# Altium schematic sheet 4 - Connectors.SchDoc
size Tabloid
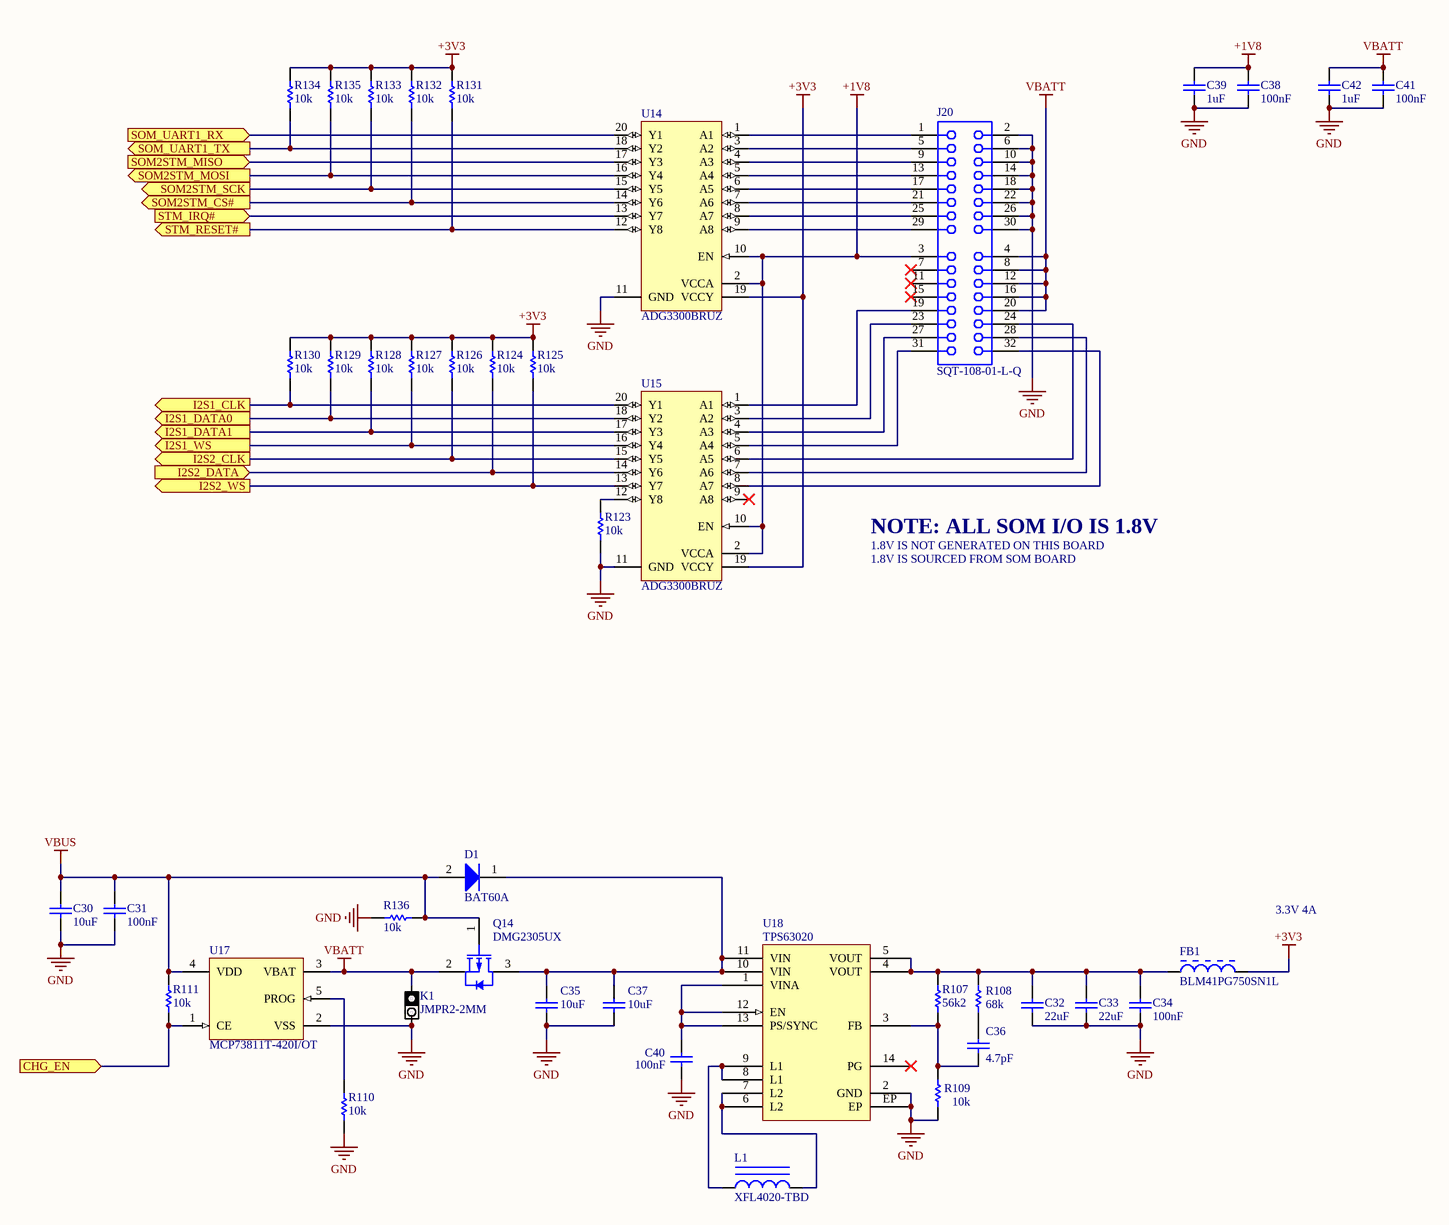
[diagram p0: 4 - Connectors.SchDoc]

## Parts
C30  value 10uF  [CAPC0805(2012)100_L]  (hidden comment: CAP 10uF 6.3V 0805(2012))
C31  value 100nF  [CAPC0805(2012)100_L]  (hidden comment: CAP 100nF 6.3V 0805(2012))
C32  value 22uF  [CAPC0805(2012)145_L]  (hidden comment: CAP 22uF 16V 0805(2012))
C33  value 22uF  [CAPC0805(2012)145_L]  (hidden comment: CAP 22uF 16V 0805(2012))
C34  value 100nF  [CAPC0805(2012)100_L]  (hidden comment: CAP 100nF 25V 0805(2012))
C35  value 10uF  [CAPC0805(2012)100_L]  (hidden comment: CAP 10uF 6.3V 0805(2012))
C36  value 4.7pF  [CAPC0805(2012)100_L]  (hidden comment: CAP 4.7pF 10V 0805(2012))
C37  value 10uF  [CAPC0805(2012)100_L]  (hidden comment: CAP 10uF 6.3V 0805(2012))
C38  value 100nF  [CAPC0805(2012)100_L]  (hidden comment: CAP 100nF 6.3V 0805(2012))
C39  value 1uF  [CAPC0805(2012)100_L]  (hidden comment: CAP 1uF 6.3V 0805(2012))
C40  value 100nF  [CAPC0805(2012)100_L]  (hidden comment: CAP 100nF 6.3V 0805(2012))
C41  value 100nF  [CAPC0805(2012)100_L]  (hidden comment: CAP 100nF 6.3V 0805(2012))
C42  value 1uF  [CAPC0805(2012)100_L]  (hidden comment: CAP 1uF 6.3V 0805(2012))
D1  BAT60A  [INF-SOD323_V]
FB1  BLM41PG750SN1L  [MURA-BLM41-B35-CHIP-2_V2]
J20  SQT-108-01-L-Q  [SMTC-SQT-108-01-X-Q]
K1  JMPR2-2MM  [JMPR2-2MM]
L1  XFL4020-TBD  [COILCRAFT_XFL4020]
Q14  DMG2305UX  [ONSC-SOT-23-3-318-08_V]
R107  value 56k2  [RESC0805(2012)_L]
R108  value 68k  [RESC0805(2012)_L]  (hidden comment: 68K 5% 0805(2012))
R109  value 10k  [RESC0805(2012)_L]  (hidden comment: 10K 1% 0805(2012))
R110  value 10k  [RESC0805(2012)_L]  (hidden comment: 10K 1% 0805(2012))
R111  value 10k  [RESC0805(2012)_L]  (hidden comment: 10K 1% 0805(2012))
R123  value 10k  [RESC0805(2012)_L]  (hidden comment: 10K 1% 0805(2012))
R124  value 10k  [RESC0805(2012)_L]  (hidden comment: 10K 1% 0805(2012))
R125  value 10k  [RESC0805(2012)_L]  (hidden comment: 10K 1% 0805(2012))
R126  value 10k  [RESC0805(2012)_L]  (hidden comment: 10K 1% 0805(2012))
R127  value 10k  [RESC0805(2012)_L]  (hidden comment: 10K 1% 0805(2012))
R128  value 10k  [RESC0805(2012)_L]  (hidden comment: 10K 1% 0805(2012))
R129  value 10k  [RESC0805(2012)_L]  (hidden comment: 10K 1% 0805(2012))
R130  value 10k  [RESC0805(2012)_L]  (hidden comment: 10K 1% 0805(2012))
R131  value 10k  [RESC0805(2012)_L]  (hidden comment: 10K 1% 0805(2012))
R132  value 10k  [RESC0805(2012)_L]  (hidden comment: 10K 1% 0805(2012))
R133  value 10k  [RESC0805(2012)_L]  (hidden comment: 10K 1% 0805(2012))
R134  value 10k  [RESC0805(2012)_L]  (hidden comment: 10K 1% 0805(2012))
R135  value 10k  [RESC0805(2012)_L]  (hidden comment: 10K 1% 0805(2012))
R136  value 10k  [RESC0805(2012)_L]  (hidden comment: 10K 1% 0805(2012))
U14  ADG3300BRUZ  [ADI-RU-20_N]
U15  ADG3300BRUZ  [ADI-RU-20_N]
U17  MCP73811T-420I/OT  [SOT-23-OT5_M]
U18  TPS63020  [VSON14]

## Ports
CHG_EN (in), I2S1_CLK (out), I2S1_DATA0 (out), I2S1_DATA1 (out), I2S1_WS (out), I2S2_CLK (out), I2S2_DATA (in), I2S2_WS (out), SOM2STM_CS# (out), SOM2STM_MISO (in), SOM2STM_MOSI (out), SOM2STM_SCK (out), SOM_UART1_RX (in), SOM_UART1_TX (out), STM_IRQ# (in), STM_RESET# (out)

## Nets
+1V8: C38.2 C39.2 J20.3 U14.2(VCCA) U14.10(EN) U15.2(VCCA) U15.10(EN)
+3V3: FB1.2 R124.1 R125.1 R126.1 R127.1 R128.1 R129.1 R130.1 R131.1 R132.1 R133.1 R134.1 R135.1 U14.19(VCCY) U15.19(VCCY)
GND: C30.1 C31.2 C32.1 C33.1 C34.1 C35.1 C37.1 C38.1 C39.1 C40.2 C41.1 C42.1 J20.2 J20.6 J20.10 J20.14 J20.18 J20.22 J20.26 J20.30 K1.2 R109.1 R110.1 R123.2 R136.2 U14.11(GND) U15.11(GND) U17.2(VSS) U18.2(GND) U18.EP
VBATT: C41.2 C42.2 J20.4 J20.8 J20.12 J20.16 J20.20 K1.1 Q14.2(S) U17.3(VBAT)
VBUS: C30.2 C31.1 D1.2(A) Q14.1(G) R111.1 R136.1 U17.4(VDD)
CHG_EN: R111.2 U17.1(CE) ; port CHG_EN
I2S1_CLK: R130.2 U15.20(Y1) ; port I2S1_CLK
I2S1_DATA0: R129.2 U15.18(Y2) ; port I2S1_DATA0
I2S1_DATA1: R128.2 U15.17(Y3) ; port I2S1_DATA1
I2S1_WS: R127.2 U15.16(Y4) ; port I2S1_WS
I2S2_CLK: R126.2 U15.15(Y5) ; port I2S2_CLK
I2S2_DATA: R124.2 U15.14(Y6) ; port I2S2_DATA
I2S2_WS: R125.2 U15.13(Y7) ; port I2S2_WS
SOM2STM_CS#: R132.2 U14.14(Y6) ; port SOM2STM_CS#
SOM2STM_MISO: U14.17(Y3) ; port SOM2STM_MISO
SOM2STM_MOSI: R135.2 U14.16(Y4) ; port SOM2STM_MOSI
SOM2STM_SCK: R133.2 U14.15(Y5) ; port SOM2STM_SCK
SOM_UART1_RX: U14.20(Y1) ; port SOM_UART1_RX
SOM_UART1_TX: R134.2 U14.18(Y2) ; port SOM_UART1_TX
STM_IRQ#: U14.13(Y7) ; port STM_IRQ#
STM_RESET#: R131.2 U14.12(Y8) ; port STM_RESET#
NetC32_2: C32.2 C33.2 C34.2 FB1.1 R107.2 R108.2 U18.4(VOUT) U18.5(VOUT)
NetC35_2: C35.2 C37.2 D1.1(K) Q14.3(D) U18.10(VIN) U18.11(VIN)
NetC36_1: C36.1 R107.1 R109.2 U18.3(FB)
NetC36_2: C36.2 R108.1
NetC40_1: C40.1 U18.1(VINA) U18.12(EN) U18.13(PS/SYNC)
NetJ20_1: J20.1 U14.1(A1)
NetJ20_5: J20.5 U14.3(A2)
NetJ20_9: J20.9 U14.4(A3)
NetJ20_13: J20.13 U14.5(A4)
NetJ20_17: J20.17 U14.6(A5)
NetJ20_19: J20.19 U15.1(A1)
NetJ20_21: J20.21 U14.7(A6)
NetJ20_23: J20.23 U15.3(A2)
NetJ20_24: J20.24 U15.6(A5)
NetJ20_25: J20.25 U14.8(A7)
NetJ20_27: J20.27 U15.4(A3)
NetJ20_28: J20.28 U15.7(A6)
NetJ20_29: J20.29 U14.9(A8)
NetJ20_31: J20.31 U15.5(A4)
NetJ20_32: J20.32 U15.8(A7)
NetL1_1: L1.1 U18.8(L1) U18.9(L1)
NetL1_2: L1.2 U18.6(L2) U18.7(L2)
NetR110_2: R110.2 U17.5(PROG)
NetR123_1: R123.1 U15.12(Y8)

Not connected (* = marked no-connect by the designer): J20 7* 11* 15*; U15 9(A8)*; U18 14(PG)*

## Notes on the sheet
- NOTE: ALL SOM I/O IS 1.8V
- 1.8V IS SOURCED FROM SOM BOARD
- 1.8V IS NOT GENERATED ON THIS BOARD
- 3.3V 4A

## Library data of the parts
C30 = CMP-1036-04917-1: CAP 10uF 6.3V Â±10% 0805 (2012 Metric) Thickness 1mm SMD; Case-EIA: 0805; Case-Metric: 2012; Max Thickness: 1 mm; Tolerance: Â±10%; Technology: SMT; Rated Voltage: 6.3 V
C31 C38 C40 C41 = CMP-1036-04391-1: CAP 100nF 6.3V Â±10% 0805 (2012 Metric) Thickness 1mm SMD; Case-EIA: 0805; Case-Metric: 2012; Rated Voltage: 6.3 V; Technology: SMT; Tolerance: Â±10%; Max Thickness: 1 mm
C32 C33 = CMP-1036-04946-1: CAP 22uF 16V Â±20% 0805 (2012 Metric) Thickness 1.45mm SMD; Case-Metric: 2012; Case-EIA: 0805; Tolerance: Â±20%; Max Thickness: 1.45 mm; Rated Voltage: 16 V; Technology: SMT
C34 = CMP-1036-04411-1: CAP 100nF 25V Â±10% 0805 (2012 Metric) Thickness 1mm SMD; Case-EIA: 0805; Case-Metric: 2012; Max Thickness: 1 mm; Rated Voltage: 25 V; Technology: SMT; Tolerance: Â±10%
C35 C37 = CMP-1036-04920-1: CAP 10uF 6.3V Â±20% 0805 (2012 Metric) Thickness 1mm SMD; Case-Metric: 2012; Case-EIA: 0805; Max Thickness: 1 mm; Tolerance: Â±20%; Rated Voltage: 6.3 V; Technology: SMT
C36 = CMP-1036-00526-1: CAP 4.7pF 10V Â±0.25pF 0805 (2012 Metric) Thickness 1mm SMD; Case-Metric: 2012; Case-EIA: 0805; Tolerance: Â±0.25pF; Rated Voltage: 10 V; Max Thickness: 1 mm; Technology: SMT
C39 C42 = CMP-1036-04730-1: CAP 1uF 6.3V Â±5% 0805 (2012 Metric) Thickness 1mm SMD; Case-Metric: 2012; Case-EIA: 0805; Technology: SMT; Tolerance: Â±5%; Max Thickness: 1 mm; Rated Voltage: 6.3 V
D1 = CMP-1183-00008-2: Silicon Schottky Diode, -55 to 85 degC, SOD323, Reel, Green; Manufacturer: Infineon; Green: TRUE; VR (max): 10Â V; IF (max): 3,000Â mA; VF (max): 370Â mV; CT (max): 35Â pF; Configuration: Single; PackageDescription: 3-Pin Small Outline Transistor Package, 1.25 x 2 mm Body, 0.65 mm Pitch; PartNumber: BAT60A; Mounting Technology: Surface Mount; PackageReference: SOT323; ComponentLink1Description: Manufacturer URL; Packing: Reel; ComponentLink3URL: http://www.infineon.com/dgdl/SOT323-Package_Overview.pdf?folderId=db3a30431936bc4b0119533e1dcb3c92&fileId=db3a30431936bc4b011953495f283cb1; ComponentLink2URL: http://www.infineon.com/dgdl/bat60aseries.pdf?folderId=db3a304313d846880113def5812204a1&fileId=db3a304313d846880113def70c9304a9; ComponentLink1URL: http://www.infineon.com/; ComponentLink2Description: Datasheet; ComponentLink3Description: Package Specification
FB1 = CMP-0686-00749-2: Chip Ferrite Bead for Power Lines, 75 Ohm, 3500 mA, -55 to 125 degC, 4.5 x 1.6 x 1.8 mm SMD, Tape and Reel; Manufacturer: Murata; Rated Current: 3500 mA; Impedance (at 100 MHz): 75 Ohm Typ.; DC Resistance: 0.015 Ohm Max.; PackageReference: BLM41-2; Packing: Tape and Reel; PartNumber: BLM41PG750SN1L; ComponentLink1URL: http://www.murata.com/; ComponentLink3Description: Package Specification; ComponentLink1Description: Manufacturer URL; ComponentLink3URL: http://www.murata.com/products/catalog/pdf/c31e.pdf; DatasheetVersion: 08/2013; PackageDescription: 2-Pin Chip, Body 4.5 x 1.6 mm; Operating Temperature Range: -55 to 125 degC; Mounting Technology: Surface Mount; ComponentLink2URL: http://www.murata.com/products/catalog/pdf/c31e.pdf; ComponentLink2Description: Datasheet
J20 = CMP-1021-00092-1: Cost-Effective Rugged Socket, Through-hole, Vertical, -55 to 125 degC, 2 mm Pitch, 32-Pin, Female, RoHS; Manufacturer: Samtec; Pitch: 2 mm; Mounting Technology: Through-hole; ComponentLink3URL: http://www.samtec.com/documents/webfiles/cpdf/SQT-1XX-XX-XXX-X-XXX-XXX-MKT.pdf; ComponentLink1URL: http://www.samtec.com; RoHS: True; DatasheetVersion: F-214; ComponentLink1Description: Manufacturer URL; PartNumber: SQT-108-01-L-Q; PackageReference: SQT-108-01-X-Q; PackageDescription: 2mm Socket Strip Assembly; ComponentLink2URL: http://www.samtec.com/documents/webfiles/pdf/SQT_TH.PDF; Orientation: Vertical; ComponentLink3Description: Package Specification; PackageVersion: BY, 7/1995; ComponentLink2Description: Datasheet; Temperature Range: -55 to 125 degC
K1 = JMPR2-2MM: JMPR2 2MM OPEN BY DEFAULT; Manufacturer: Sullins Connector Solutions; Manufacturer Part Number: PBC36SAAN; Supplier 1: Digi-Key; Supplier Part Number 1: S1011E-36-ND; Reel: Open
L1 = SHIELDED_INDUCTOR
Q14 = CMP-1058-00762-1: Power MOSFET Single P-Channel, -50 V, 10 Ohm, 3-Pin SOT-23, Pb-Free, Tape and Reel; Manufacturer: On Semiconductor; PartNumber: BSS84LT1G; Ciss Typ (pF): 36; ID Max (A): 0.13; Channel Polarity: P Channel; VGS(th) Max (V): 2; VGS Max (V): 20; V(BR)DSS Min (V): 50; Crss Typ (pF): 6.5; PD Max (W): 0.225; Coss Typ (pF): 17; Configuration: Single; Mounting Technology: Surface Mount; ComponentLink3URL: http://www.onsemi.cn/pub_link/Collateral/318-08.PDF; ComponentLink1Description: Manufacturer URL; Package Type: SOT-23-3; ComponentLink2URL: http://www.onsemi.com/pub_link/Collateral/BSS84LT1-D.PDF; RoHS: Pb-Free; Packing: Tape and Reel; ComponentLink1URL: http://www.onsemi.com/; PackageVersion: Rev. AP, 11/2009; PackageReference: SOT-23-3-318-08; PackageDescription: 3-Pin Small Outline Transistor, Body 2.92 x 1.3 mm, Pitch 0.95 mm; DatasheetVersion: Rev. 8; ComponentLink3Description: Package Specification; ComponentLink2Description: Datasheet
R107 = CMP-1013-00645-1: 56k2 1% 0805(2012); Case-Metric: 2012; Case-EIA: 0805; Power: 0.125 W; Tolerance: 1 %; Technology: SMT
R108 = CMP-1013-00118-1: 68K 0.125W 5% 0805 (2012 Metric)  SMD; Case-EIA: 0805; Case-Metric: 2012; Technology: SMT; Power: 0.125 W; Tolerance: 5 %
R109 = CMP-1013-00645-1: 10K 0.125W 1% 0805 (2012 Metric)  SMD; Case-Metric: 2012; Case-EIA: 0805; Tolerance: 1 %; Technology: SMT; Power: 0.125 W
R110 R111 R123-R136 = CMP-1013-00623-1: 10K 0.125W 1% 0805 (2012 Metric)  SMD; Case-Metric: 2012; Case-EIA: 0805; Tolerance: 1 %; Power: 0.125 W; Technology: SMT
U14 U15 = CMP-0791-00060-1: Low Voltage 1.15 V to 5.5 V, 8-Channel Bidirectional Logic Level Translator, -40 to 85 degC, 20-pin SOP (RU-20), Tube; Manufacturer: Analog Devices; Bus Enable Time (typ): 1us; Mounting Technology: Surface Mount; DatasheetVersion: Rev. 0; ComponentLink1Description: Manufacturer URL; ComponentLink2URL: http://www.analog.com/static/imported-files/data_sheets/ADG3300.pdf; PackageVersion: Jan-03; ComponentLink2Description: Datasheet; PackageReference: RU-20; ComponentLink3URL: http://www.analog.com/static/imported-files/packages/364515793657813558433715854054607941441RU20.pdf; PackageDescription: 20-Pin Thin Shrink Small Outline Package, Body 6.5 x 4.4 mm, Pitch 0.65 mm; PartNumber: ADG3300BRUZ; Code_JEDEC: MO-153AC; ComponentLink3Description: Package Specification; ComponentLink1URL: http://www.analog.com/en/index.html
U17 = CMP-0133-00139-1: Simple, Miniature Single-Cell, Fully Integrated Li-Ion/Li-Polymer Charge Management Controller, 4.2V, 5-Pin SOT-23, Industrial Temperature, Tape and Reel; Code_IPC: SOT23-5; PackageDescription: 5-Lead Plastic Small Outline Transistor (OT) [SOT-23]; PackageVersion: revBB, Aug-2009; DatasheetVersion: revB, Sep-2007; PackageReference: SOT-23-OT5
U18 = TPS63020: pin to pad: EP>15